# EAGLE schematic keypad (EAGLE 9.6.2)
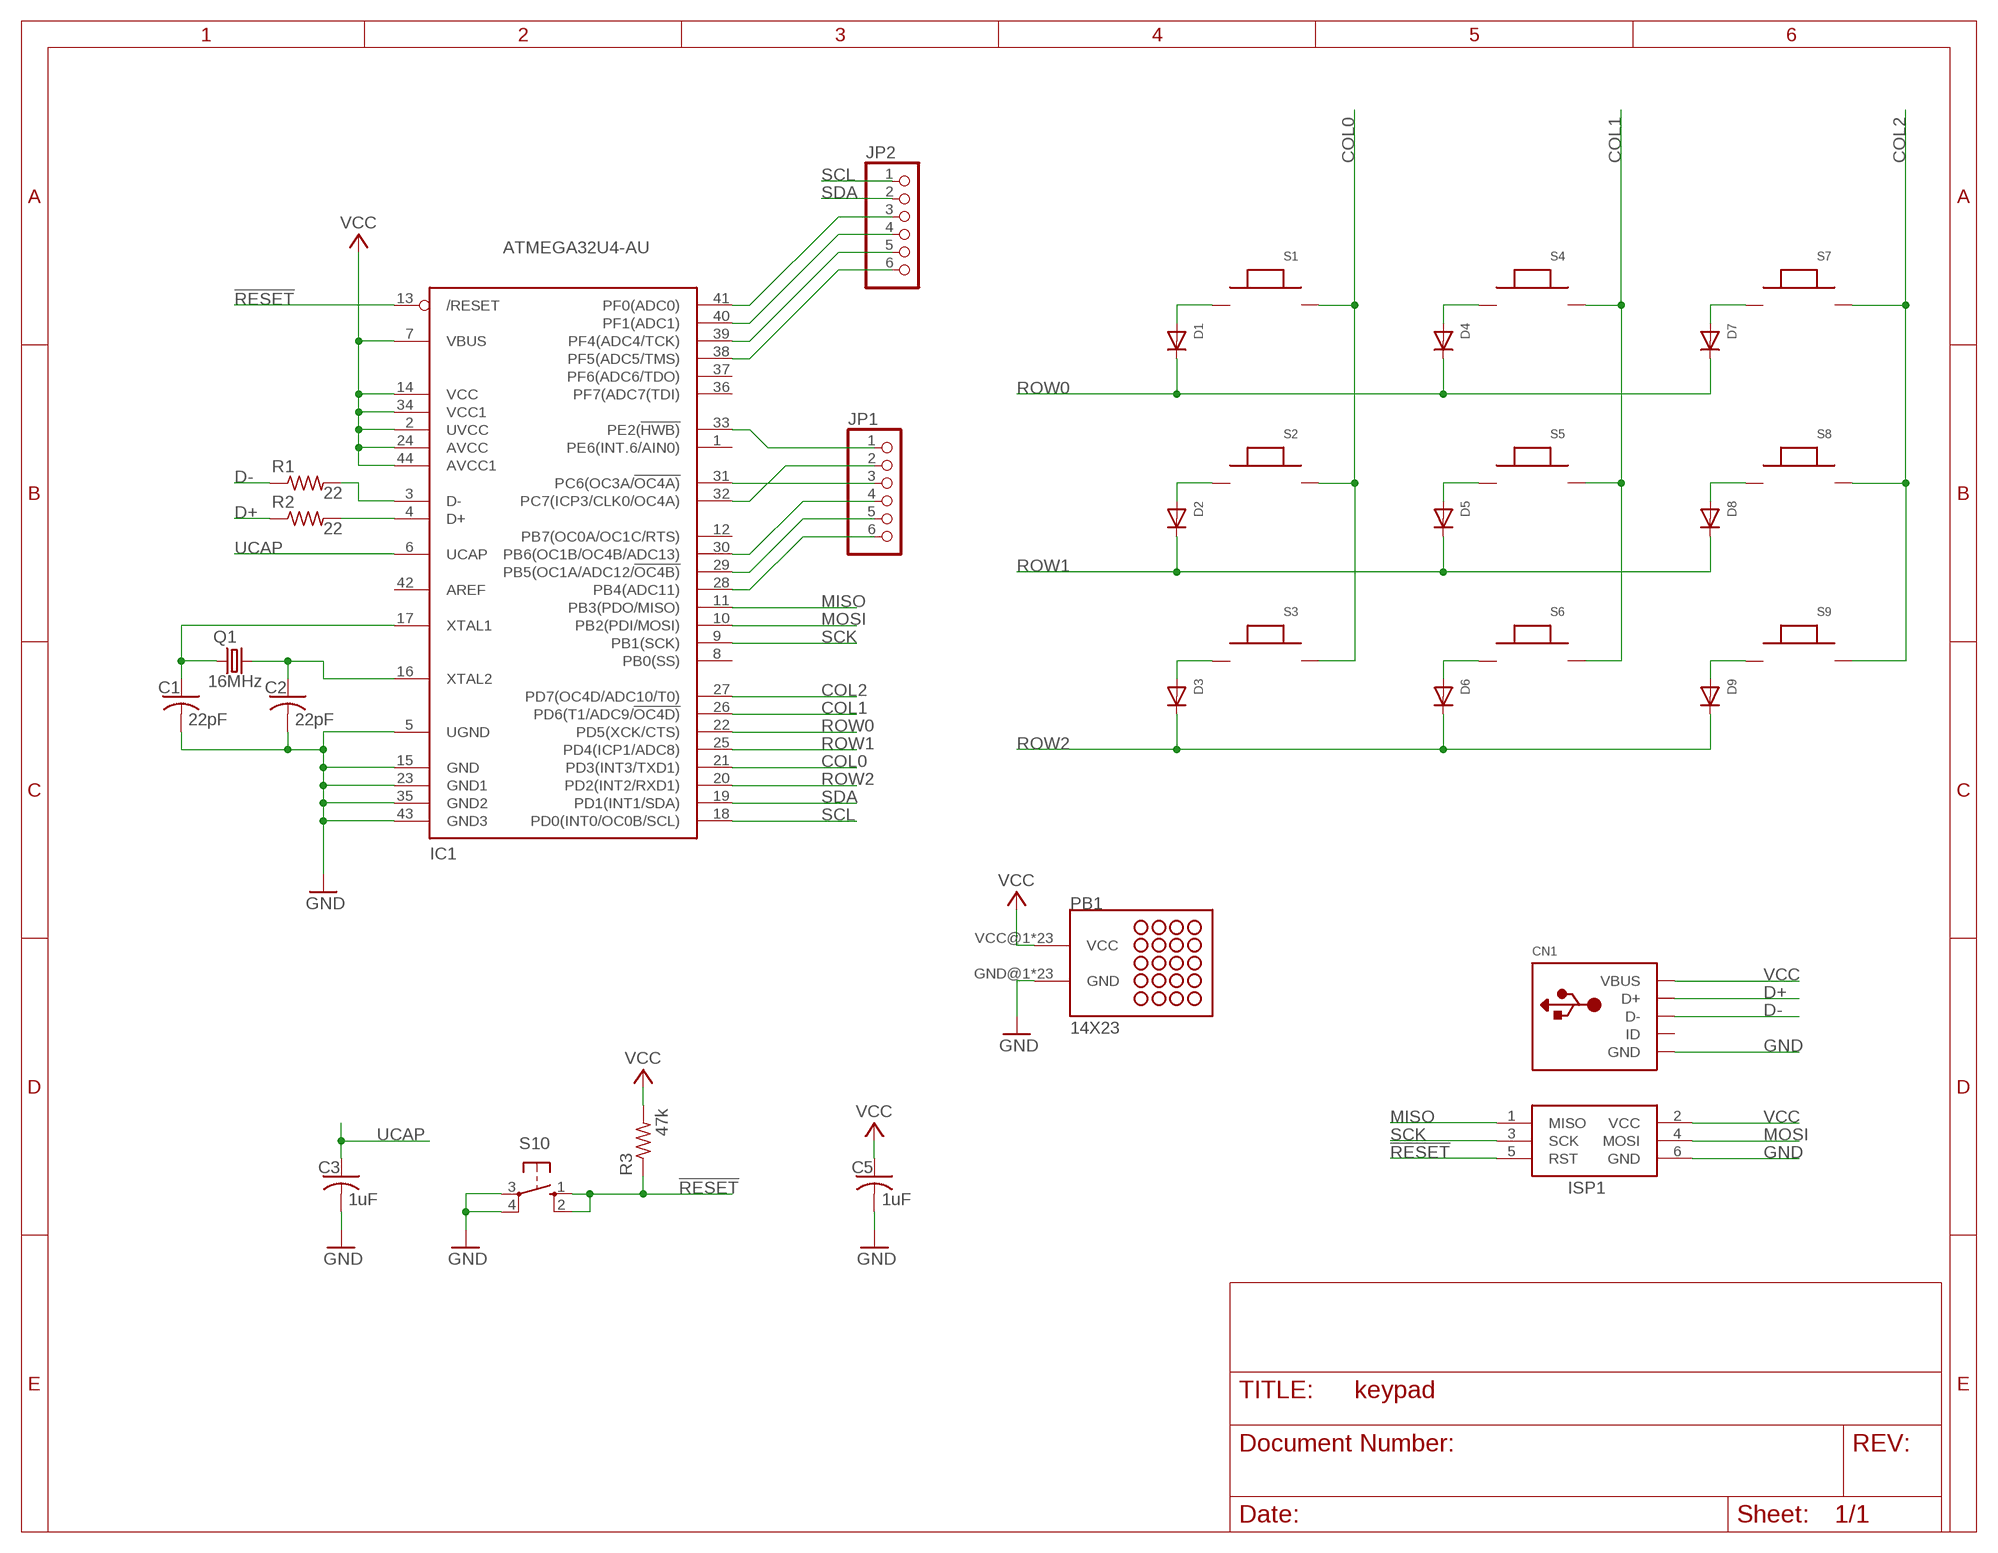
[diagram p0: schematic, sheet 1]

## Parts
C1  22pF  C-USC0805  [C0805]
C2  22pF  C-USC0805  [C0805]
C3  1uF  C-USC0805  [C0805]
C5  1uF  C-USC0805  [C0805]
CN1  USBMOLEX  [USB-MINIB-THM-MOLEX]
D1  DIODESOD-123  [SOD-123]
D2  DIODESOD-123  [SOD-123]
D3  DIODESOD-123  [SOD-123]
D4  DIODESOD-123  [SOD-123]
D5  DIODESOD-123  [SOD-123]
D6  DIODESOD-123  [SOD-123]
D7  DIODESOD-123  [SOD-123]
D8  DIODESOD-123  [SOD-123]
D9  DIODESOD-123  [SOD-123]
IC1  ATMEGA32U4-AU  [TQFP44]
ISP1  AVRISP-6  [AVRISP]
JP1  PINHD-1X6  [1X06]
JP2  PINHD-1X6  [1X06]
PB1  14X23  [14X23]
Q1  16MHz  CRYSTALHC49S  [HC49/S]
R1  22  R-US_R0805  [R0805]
R2  22  R-US_R0805  [R0805]
R3  47k  R-US_R0805  [R0805]
S1  MX-SMD  [MX_SMD]
S2  MX-SMD  [MX_SMD]
S3  MX-SMD  [MX_SMD]
S4  MX-SMD  [MX_SMD]
S5  MX-SMD  [MX_SMD]
S6  MX-SMD  [MX_SMD]
S7  MX-SMD  [MX_SMD]
S8  MX-SMD  [MX_SMD]
S9  MX-SMD  [MX_SMD]
S10  10-XX  [B3F-10XX]

## Nets
!RESET: IC1.13(/RESET) ISP1.5(RST) R3.1 S10.1(S) S10.2(S1)
COL0: IC1.21(PD3(INT3/TXD1)) S1.P$2 S2.P$2 S3.P$2
COL1: IC1.26(PD6(T1/ADC9/!OC4D)) S4.P$2 S5.P$2 S6.P$2
COL2: IC1.27(PD7(OC4D/ADC10/T0)) S7.P$2 S8.P$2 S9.P$2
D+: CN1.D+ R2.1
D-: CN1.D- R1.1
GND: C1.2 C2.2 C3.2 C5.2 CN1.GND IC1.5(UGND) IC1.15(GND) IC1.23(GND1) IC1.35(GND2) IC1.43(GND3) ISP1.6(GND) PB1.GND@1(GND) PB1.GND@2(GND) PB1.GND@3(GND) PB1.GND@4(GND) PB1.GND@5(GND) PB1.GND@6(GND) PB1.GND@7(GND) PB1.GND@8(GND) PB1.GND@9(GND) PB1.GND@10(GND) PB1.GND@11(GND) PB1.GND@12(GND) PB1.GND@13(GND) PB1.GND@14(GND) PB1.GND@15(GND) PB1.GND@16(GND) PB1.GND@17(GND) PB1.GND@18(GND) PB1.GND@19(GND) PB1.GND@20(GND) PB1.GND@21(GND) PB1.GND@22(GND) PB1.GND@23(GND) S10.3(P) S10.4(P1)
MISO: IC1.11(PB3(PDO/MISO)) ISP1.1(MISO)
MOSI: IC1.10(PB2(PDI/MOSI)) ISP1.4(MOSI)
N$3: D4.A S4.P$1
N$4: D5.A S5.P$1
N$5: D1.A S1.P$1
N$6: D2.A S2.P$1
N$7: IC1.3(D-) R1.2
N$8: IC1.4(D+) R2.2
N$9: D7.A S7.P$1
N$10: D9.A S9.P$1
N$11: D8.A S8.P$1
N$12: D6.A S6.P$1
N$14: D3.A S3.P$1
PB4: IC1.28(PB4(ADC11)) JP1.6
PB5: IC1.29(PB5(OC1A/ADC12/!OC4B)) JP1.5
PB6: IC1.30(PB6(OC1B/OC4B/ADC13)) JP1.4
PC6: IC1.31(PC6(OC3A/!OC4A)) JP1.3
PC7: IC1.32(PC7(ICP3/CLK0/OC4A)) JP1.2
PE2: IC1.33(PE2(!HWB)) JP1.1
PF0: IC1.41(PF0(ADC0)) JP2.3
PF1: IC1.40(PF1(ADC1)) JP2.4
PF4: IC1.39(PF4(ADC4/TCK)) JP2.5
PF5: IC1.38(PF5(ADC5/TMS)) JP2.6
ROW0: D1.C D4.C D7.C IC1.22(PD5(XCK/CTS))
ROW1: D2.C D5.C D8.C IC1.25(PD4(ICP1/ADC8))
ROW2: D3.C D6.C D9.C IC1.20(PD2(INT2/RXD1))
SCK: IC1.9(PB1(SCK)) ISP1.3(SCK)
SCL: IC1.18(PD0(INT0/OC0B/SCL)) JP2.1
SDA: IC1.19(PD1(INT1/SDA)) JP2.2
UCAP: C3.1 IC1.6(UCAP)
VCC: C5.1 CN1.VBUS IC1.2(UVCC) IC1.7(VBUS) IC1.14(VCC) IC1.24(AVCC) IC1.34(VCC1) IC1.44(AVCC1) ISP1.2(VCC) PB1.VCC@1(VCC) PB1.VCC@2(VCC) PB1.VCC@3(VCC) PB1.VCC@4(VCC) PB1.VCC@5(VCC) PB1.VCC@6(VCC) PB1.VCC@7(VCC) PB1.VCC@8(VCC) PB1.VCC@9(VCC) PB1.VCC@10(VCC) PB1.VCC@11(VCC) PB1.VCC@12(VCC) PB1.VCC@13(VCC) PB1.VCC@14(VCC) PB1.VCC@15(VCC) PB1.VCC@16(VCC) PB1.VCC@17(VCC) PB1.VCC@18(VCC) PB1.VCC@19(VCC) PB1.VCC@20(VCC) PB1.VCC@21(VCC) PB1.VCC@22(VCC) PB1.VCC@23(VCC) R3.2
XTAL1: C1.1 IC1.17(XTAL1) Q1.1
XTAL2: C2.1 IC1.16(XTAL2) Q1.2
Unconnected: CN1.ID IC1.1(PE6(INT.6/AIN0)) IC1.8(PB0(SS)) IC1.12(PB7(OC0A/OC1C/RTS)) IC1.36(PF7(ADC7(TDI)) IC1.37(PF6(ADC6/TDO)) IC1.42(AREF)

## Library data of the parts
C1-C3 C5 = rcl:C-US: CAPACITOR, American symbol; SPICEPREFIX: C
CN1 = adafruit:USB: USB Connectors USBMINIB - Surface Mount Female Mini-B USB Connector 4UConnector: 06564 By microbuilder.eu Thru-hole RA Female Mini-B USB Connector 4UConnector: 18732 By ladyada.net
D1-D9 = adafruit:DIODE: Diode SMADIODE - SMA Surface Mount Package 20V 1A Schottky Diode Digikey: 641-1014-6-ND DO-1N4148 - Through Hole Small Current Diode SOD-123 20V 1 A (.5mV Vf) Schottky Diode - Digikey: MBRX120TPMSCT-ND SOD-323 10V 570mA (.38mV Vf, 3ns) Schottky Diode - Digikey: ZLLS410CT-ND SOD-523 30V 30mA Schottky Diode (RB751S-40TE61) - Digikey: RB751S-40TE61CT-ND SOT23-R/W - SOT23 Package (R = Solder Paste/Reflow Ovens, W = Hand-Soldering) BAT54Film 40V 300mA - Digikey: 497-7162-1-ND
IC1 = adafruit:ATMEGA32U4: http://www.ladyada.net/library/eagle
ISP1 = adafruit:AVRISP: AVR ISP HEADER Standard 6 pin header for AVR programming
JP1 JP2 = adafruit:PINHD-1X6: PIN HEADER
PB1 = Protoboard:14X23
Q1 = crystal:CRYSTAL: CRYSTAL; OC_FARNELL: 1667008; OC_NEWARK: unknown
R1-R3 = rcl:R-US_: RESISTOR, American symbol; SPICEPREFIX: R
S1-S9 = MX_Switch:MX-SMD
S10 = switch-omron:10-XX: OMRON SWITCH; MPN: B3F-1000; OC_FARNELL: 176432; OC_NEWARK: 36M3542